# Altium schematic sheet HIGHSPEED_v0_SF2_DDR.SchDoc
size A3
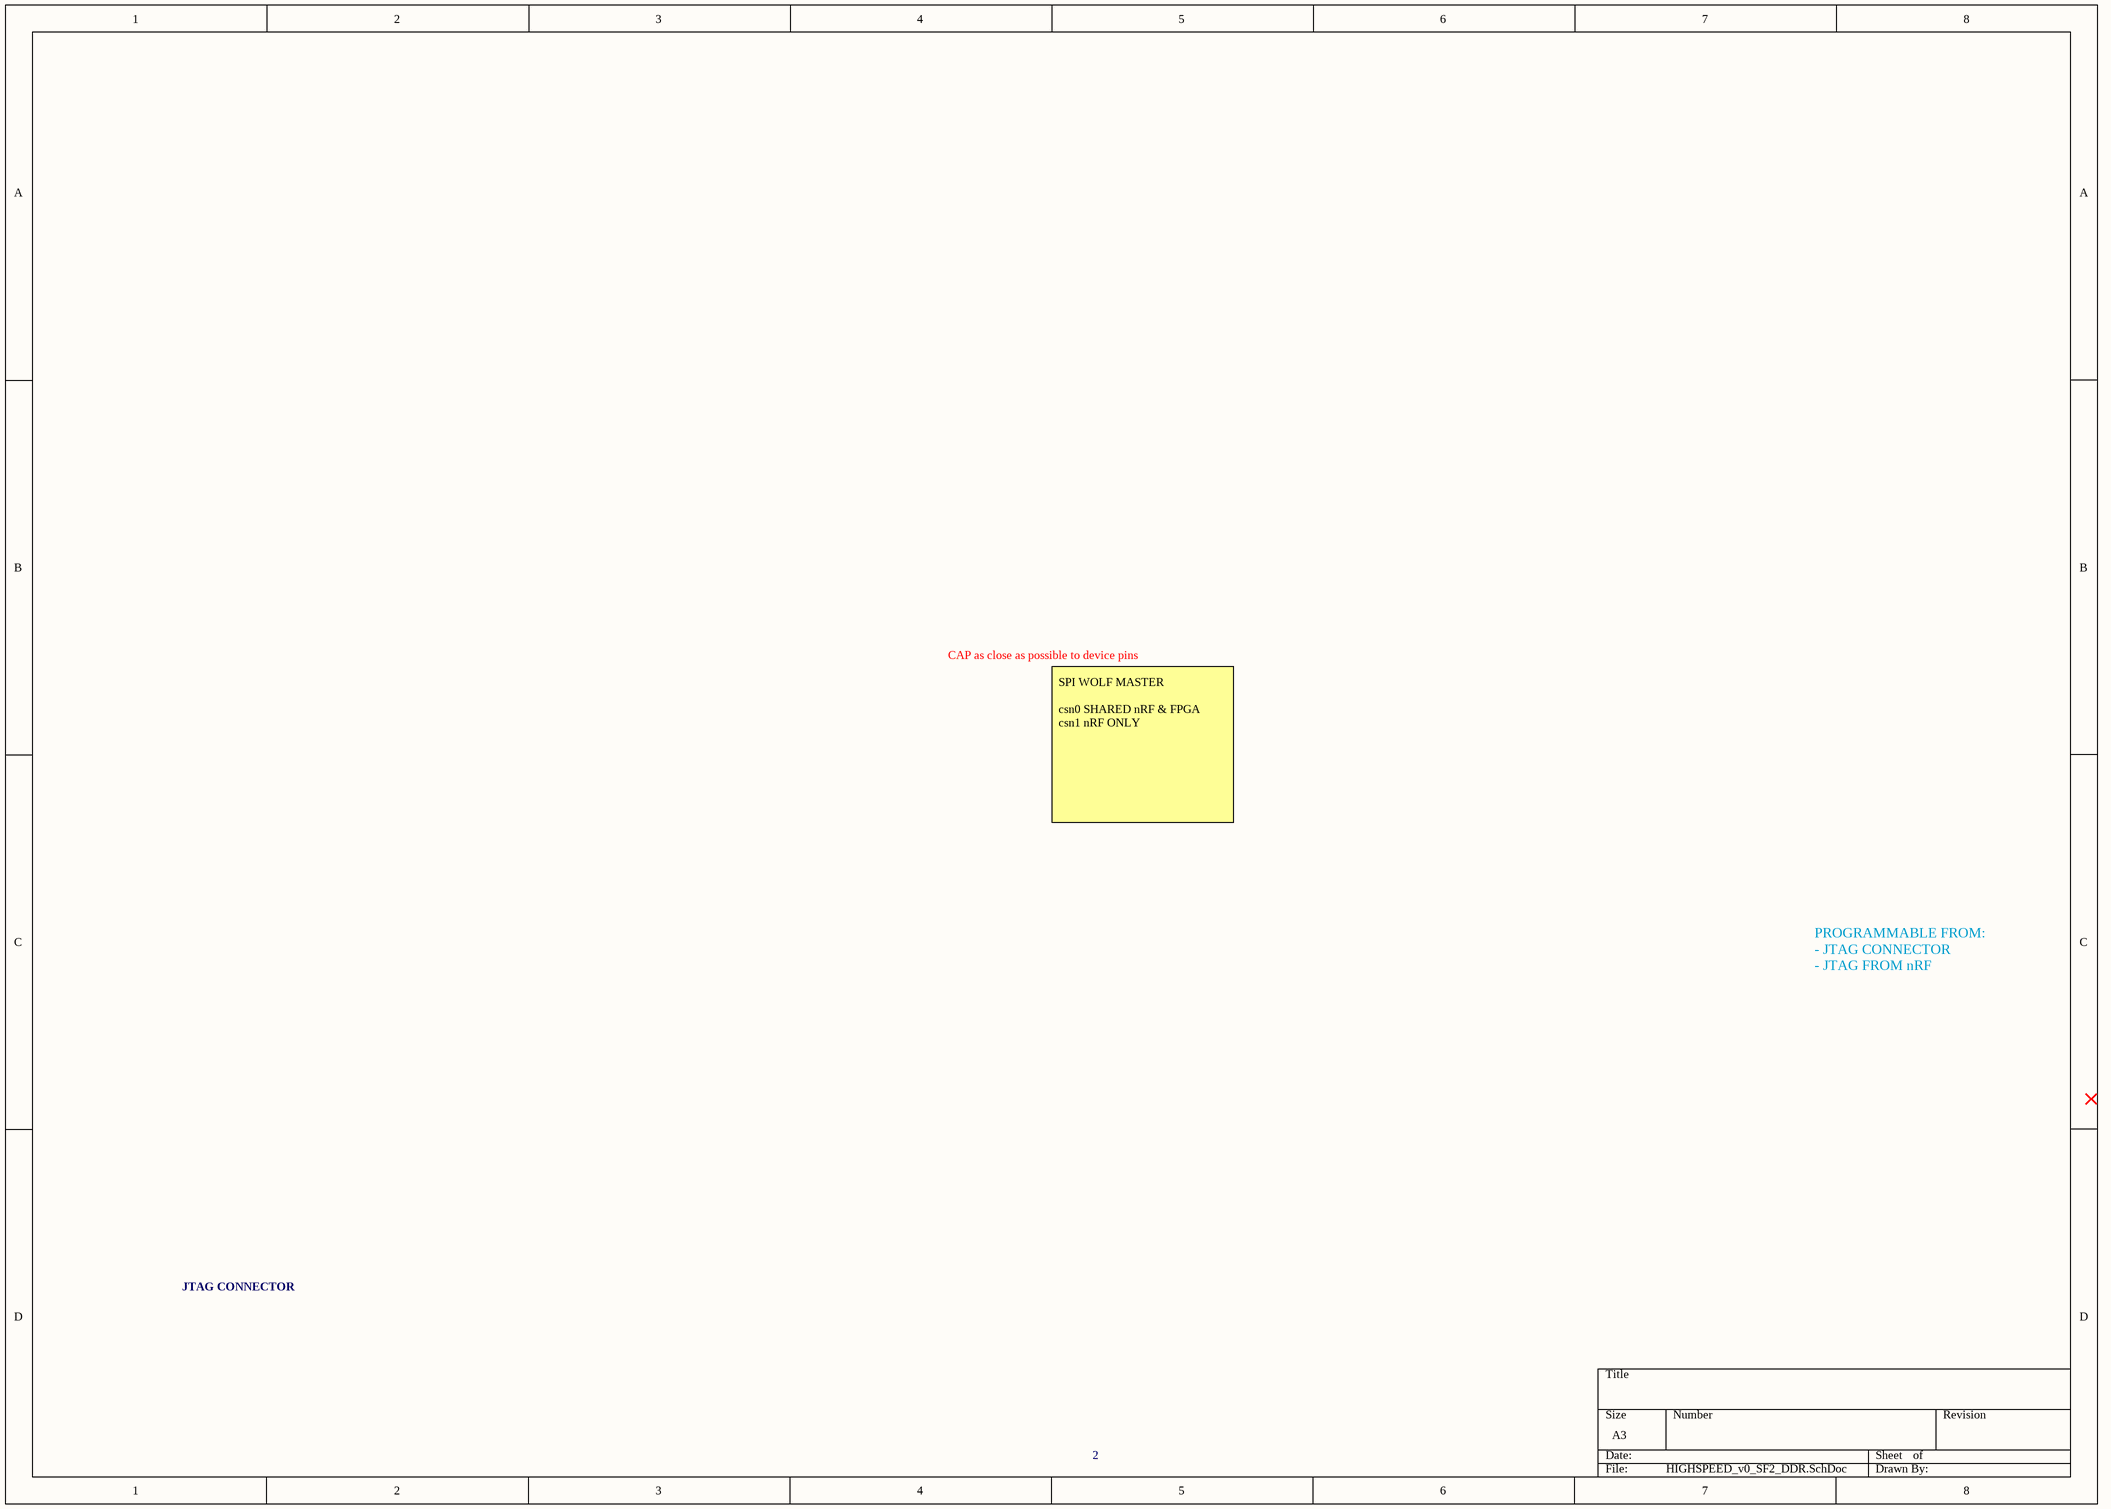
[diagram p0: HIGHSPEED_v0_SF2_DDR.SchDoc]

## Notes on the sheet
- CAP as close as possible to device pins
- SPI WOLF MASTER
  csn0 SHARED nRF & FPGA
  csn1 nRF ONLY
- PROGRAMMABLE FROM:
  - JTAG CONNECTOR
  - JTAG FROM nRF
- JTAG CONNECTOR
- 2